# EAGLE design MainBoard (EAGLE 6.3)
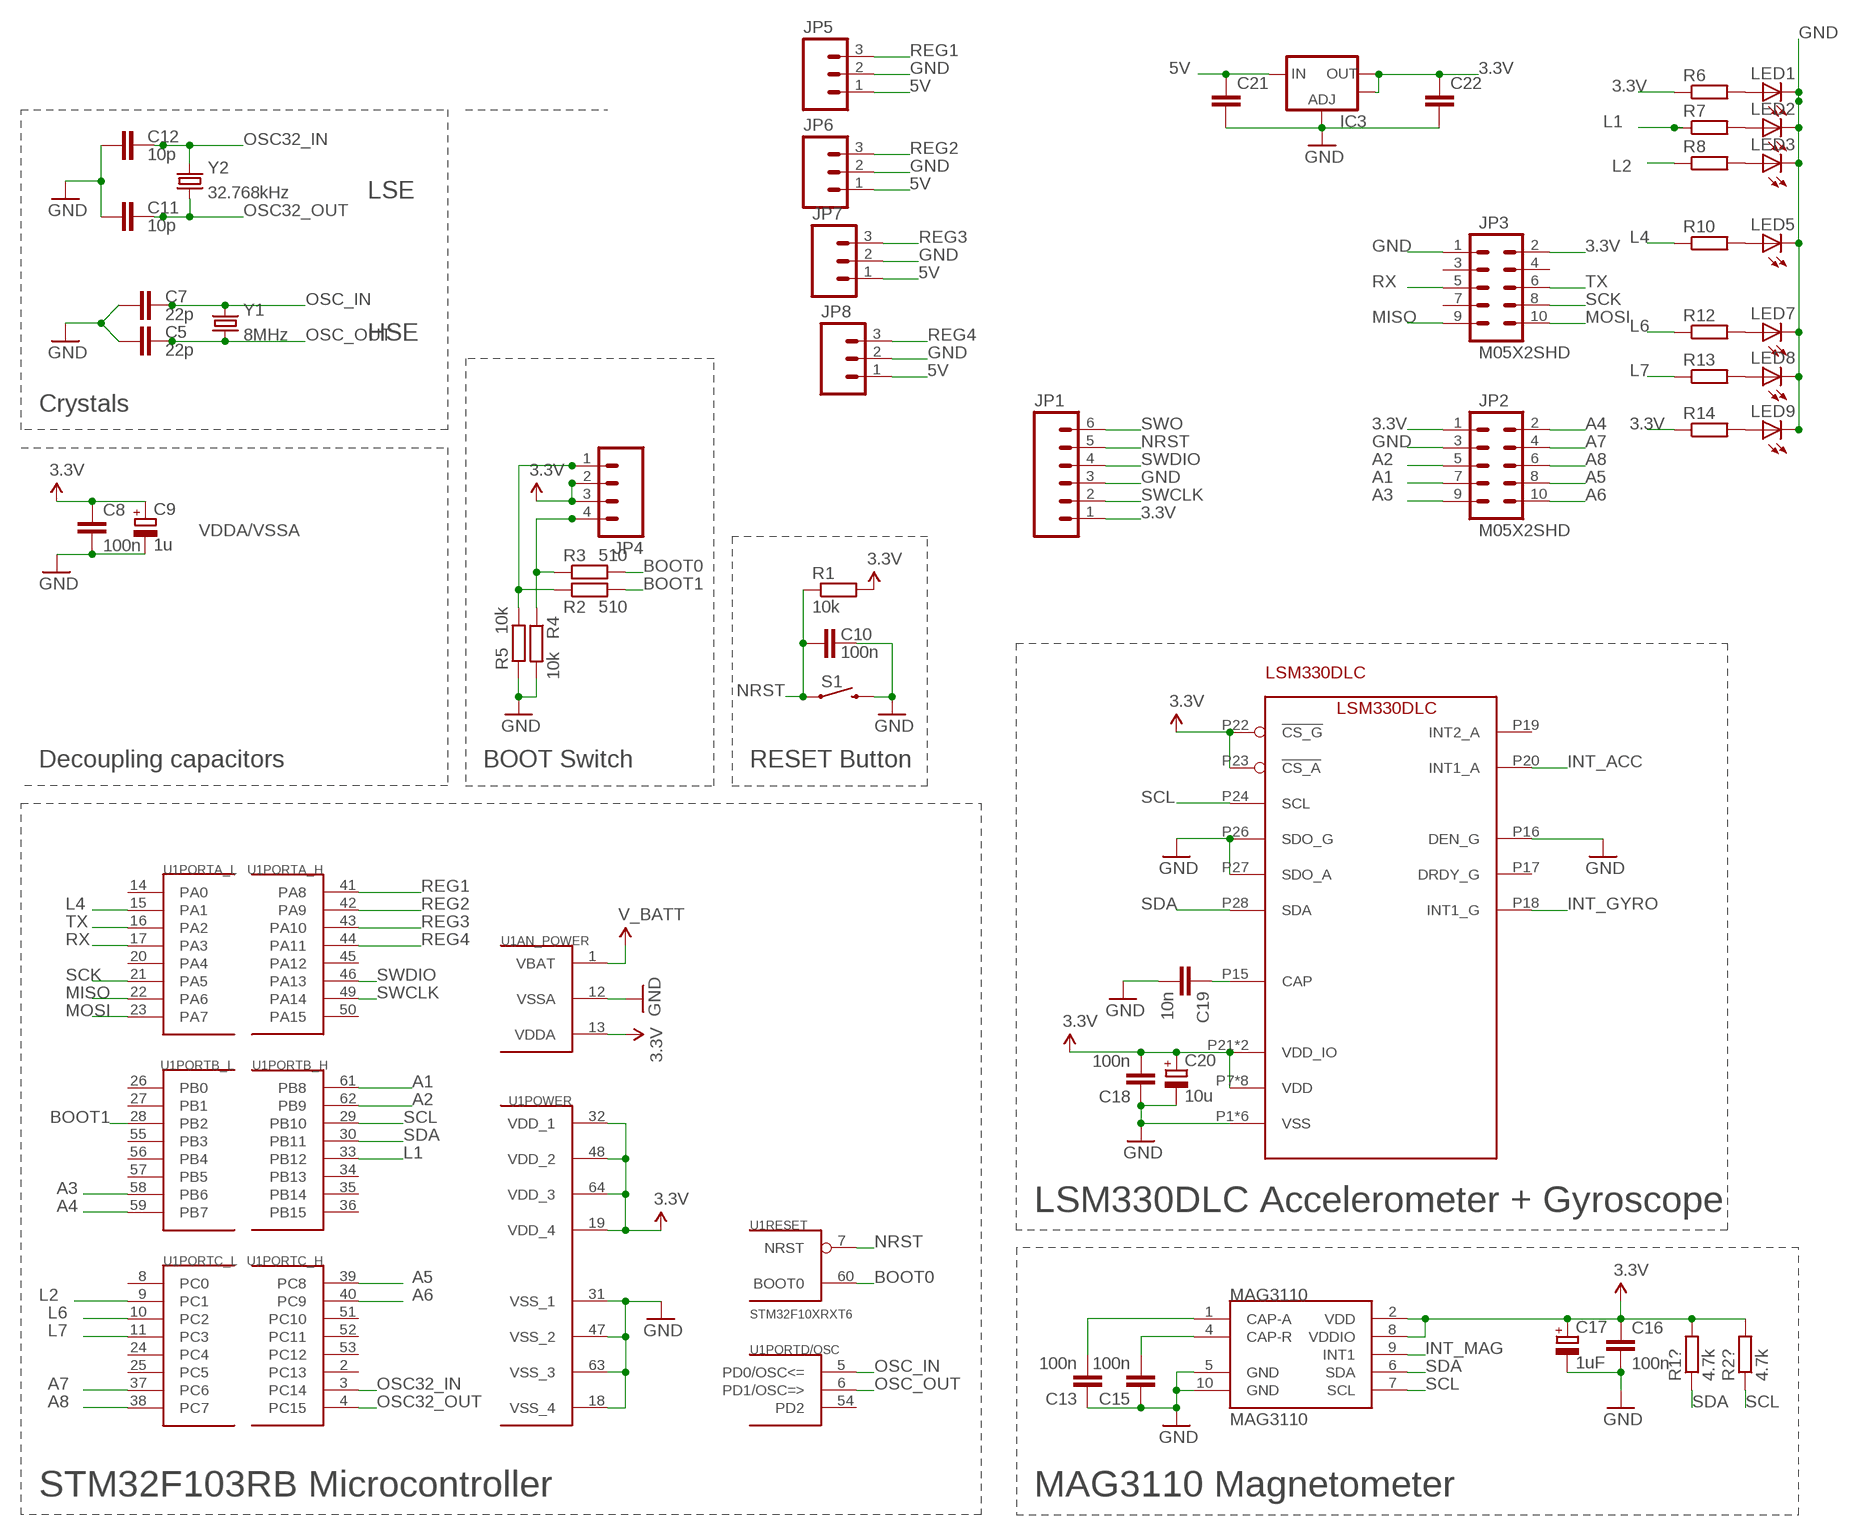
[diagram p0: schematic, sheet 1]

## Parts
C5  22p  C-EUC0805  [C0805]
C7  22p  C-EUC0805  [C0805]
C8  100n  C-EUC0805  [C0805]
C9  1u  CPOL-EUSMCA  [SMC_A]
C10  100n  C-EUC0805  [C0805]
C11  10p  C-EUC0805  [C0805]
C12  10p  C-EUC0805  [C0805]
C13  100n  C-EUC0805  [C0805]
C15  100n  C-EUC0805  [C0805]
C16  100n  C-EUC0805  [C0805]
C17  1uF  CPOL-EUSMCA  [SMC_A]
C18  100n  C-EUC0805  [C0805]
C19  10n  C-EUC0805  [C0805]
C20  10u  CPOL-EUSMCA  [SMC_A]
C21  C-EUC0805  [C0805]
C22  C-EUC0805  [C0805]
IC3  V_REG_LM1117SOT223  [SOT223]
JP1  M06LONGPADS  [1X06_LONGPADS]
JP2  M05X2SHD  [2X5-SHROUDED]
JP3  M05X2SHD  [2X5-SHROUDED]
JP4  M04LONGPADS  [1X04_LONGPADS]
JP5  M03LONGPADS  [1X03_LONGPADS]
JP6  M03LONGPADS  [1X03_LONGPADS]
JP7  M03LONGPADS  [1X03_LONGPADS]
JP8  M03LONGPADS  [1X03_LONGPADS]
LED1  LEDCHIPLED_0805  [CHIPLED_0805]
LED2  LEDCHIPLED_0805  [CHIPLED_0805]
LED3  LEDCHIPLED_0805  [CHIPLED_0805]
LED5  LEDCHIPLED_0805  [CHIPLED_0805]
LED7  LEDCHIPLED_0805  [CHIPLED_0805]
LED8  LEDCHIPLED_0805  [CHIPLED_0805]
LED9  LEDCHIPLED_0805  [CHIPLED_0805]
LSM330DLC  LSM330DLC  [LGA_4X5X1P1_28L]
MAG3110  MAG3110  [DFN-10]
R1  10k  R-EU_R0805  [R0805]
R1?  4.7k  R-EU_R0805  [R0805]
R2  510  R-EU_R0805  [R0805]
R2?  4.7k  R-EU_R0805  [R0805]
R3  510  R-EU_R0805  [R0805]
R4  10k  R-EU_R0805  [R0805]
R5  10k  R-EU_R0805  [R0805]
R6  R-EU_M0805  [M0805]
R7  R-EU_M0805  [M0805]
R8  R-EU_M0805  [M0805]
R10  R-EU_M0805  [M0805]
R12  R-EU_M0805  [M0805]
R13  R-EU_M0805  [M0805]
R14  R-EU_M0805  [M0805]
S1  SWITCH-MOMENTARY-2-SMD-1101NE  [TACTILE-SWITCH-1101NE]
U1  STM32F10XRXT6  [TQFP64]
Y1  8MHz  CRYSTALSMD  [HC49UP]
Y2  32.768kHz  CRYSTALEPSONMC146  [CRYSTAL-32KHZ-SMD_EPSON_MC146]

## Nets
3.3V: C8.1 C9.+ C16.1 C17.+ C18.2 C20.+ C22.1 IC3.2(OUT) IC3.4(OUT) JP1.1 JP2.1 JP3.2 JP4.2 JP4.3 LSM330DLC.P7(VDD) LSM330DLC.P8(VDD) LSM330DLC.P9(VDD) LSM330DLC.P10(VDD) LSM330DLC.P11(VDD) LSM330DLC.P12(VDD) LSM330DLC.P13(VDD) LSM330DLC.P14(VDD) LSM330DLC.P21(VDD_IO) LSM330DLC.P22(!CS_G) LSM330DLC.P23(!CS_A) LSM330DLC.P25(VDD_IO) MAG3110.2(VDD) MAG3110.8(VDDIO) R1.2 R1?.2 R2?.2 R6.1 R14.1 U1.13(AN_POWER:VDDA) U1.19(POWER:VDD_4) U1.32(POWER:VDD_1) U1.48(POWER:VDD_2) U1.64(POWER:VDD_3)
5V: C21.1 IC3.3(IN) JP5.1 JP6.1 JP7.1 JP8.1
A1: JP2.7 U1.61(PORTB_H:PB8)
A2: JP2.5 U1.62(PORTB_H:PB9)
A3: JP2.9 U1.58(PORTB_L:PB6)
A4: JP2.2 U1.59(PORTB_L:PB7)
A5: JP2.8 U1.39(PORTC_H:PC8)
A6: JP2.10 U1.40(PORTC_H:PC9)
A7: JP2.4 U1.37(PORTC_L:PC6)
A8: JP2.6 U1.38(PORTC_L:PC7)
BOOT0: R3.2 U1.60(RESET:BOOT0)
BOOT1: R2.2 U1.28(PORTB_L:PB2)
GND: C5.1 C7.1 C8.2 C9.- C10.2 C11.1 C12.1 C13.1 C15.1 C16.2 C17.- C18.1 C19.2 C20.- C21.2 C22.2 IC3.1(ADJ) JP1.3 JP2.3 JP3.1 JP5.2 JP6.2 JP7.2 JP8.2 LED1.C LED2.C LED3.C LED5.C LED7.C LED8.C LED9.C LSM330DLC.P1(VSS) LSM330DLC.P2(VSS) LSM330DLC.P3(VSS) LSM330DLC.P4(VSS) LSM330DLC.P5(VSS) LSM330DLC.P6(VSS) LSM330DLC.P16(DEN_G) LSM330DLC.P26(SDO_G) LSM330DLC.P27(SDO_A) MAG3110.5(GND) MAG3110.10(GND) R4.2 R5.1 S1.P$2 U1.12(AN_POWER:VSSA) U1.18(POWER:VSS_4) U1.31(POWER:VSS_1) U1.47(POWER:VSS_2) U1.63(POWER:VSS_3)
INT_ACC: LSM330DLC.P20(INT1_A)
INT_GYRO: LSM330DLC.P18(INT1_G)
INT_MAG: MAG3110.9(INT1)
L1: R7.1 U1.33(PORTB_H:PB12)
L2: R8.1 U1.9(PORTC_L:PC1)
L4: R10.1 U1.15(PORTA_L:PA1)
L6: R12.1 U1.10(PORTC_L:PC2)
L7: R13.1 U1.11(PORTC_L:PC3)
MISO: JP3.9 U1.22(PORTA_L:PA6)
MOSI: JP3.10 U1.23(PORTA_L:PA7)
N$1: JP4.1 R2.1 R5.2
N$2: JP4.4 R3.1 R4.1
N$3: C15.2 MAG3110.4(CAP-R)
N$4: C13.2 MAG3110.1(CAP-A)
N$5: C19.1 LSM330DLC.P15(CAP)
N$6: LED1.A R6.2
N$7: LED2.A R7.2
N$8: LED3.A R8.2
N$10: LED5.A R10.2
N$12: LED7.A R12.2
N$13: LED8.A R13.2
N$14: LED9.A R14.2
NRST: C10.1 JP1.5 R1.1 S1.P$1 U1.7(RESET:NRST)
OSC32_IN: C12.2 U1.3(PORTC_H:PC14) Y2.P$1
OSC32_OUT: C11.2 U1.4(PORTC_H:PC15) Y2.P$2
OSC_IN: C7.2 U1.5(PORTD/OSC:PD0/OSC<=) Y1.2
OSC_OUT: C5.2 U1.6(PORTD/OSC:PD1/OSC=>) Y1.1
REG1: JP5.3 U1.41(PORTA_H:PA8)
REG2: JP6.3 U1.42(PORTA_H:PA9)
REG3: JP7.3 U1.43(PORTA_H:PA10)
REG4: JP8.3 U1.44(PORTA_H:PA11)
RX: JP3.5 U1.17(PORTA_L:PA3)
SCK: JP3.8 U1.21(PORTA_L:PA5)
SCL: LSM330DLC.P24(SCL) MAG3110.7(SCL) R2?.1 U1.29(PORTB_H:PB10)
SDA: LSM330DLC.P28(SDA) MAG3110.6(SDA) R1?.1 U1.30(PORTB_H:PB11)
SWCLK: JP1.2 U1.49(PORTA_H:PA14)
SWDIO: JP1.4 U1.46(PORTA_H:PA13)
SWO: JP1.6
TX: JP3.6 U1.16(PORTA_L:PA2)
V_BATT: U1.1(AN_POWER:VBAT)
Unconnected: JP3.3 JP3.4 JP3.7 LSM330DLC.P17(DRDY_G) LSM330DLC.P19(INT2_A) U1.2(PORTC_H:PC13) U1.8(PORTC_L:PC0) U1.14(PORTA_L:PA0) U1.20(PORTA_L:PA4) U1.24(PORTC_L:PC4) U1.25(PORTC_L:PC5) U1.26(PORTB_L:PB0) U1.27(PORTB_L:PB1) U1.34(PORTB_H:PB13) U1.35(PORTB_H:PB14) U1.36(PORTB_H:PB15) U1.45(PORTA_H:PA12) U1.50(PORTA_H:PA15) U1.51(PORTC_H:PC10) U1.52(PORTC_H:PC11) U1.53(PORTC_H:PC12) U1.54(PORTD/OSC:PD2) U1.55(PORTB_L:PB3) U1.56(PORTB_L:PB4) U1.57(PORTB_L:PB5)

## Notes on the sheet
- LSE
- HSE
- Crystals
- VDDA/VSSA
- Decoupling capacitors | BOOT Switch | RESET Button
- LSM330DLC Accelerometer + Gyroscope
- STM32F103RB Microcontroller | MAG3110 Magnetometer

## Library data of the parts
C5 C7 C8 C10-C13 C15 C16 C21 C22 = rcl:C-EU: CAPACITOR, European symbol
C9 C17 C20 = rcl:CPOL-EU: POLARIZED CAPACITOR, European symbol
C18 C19 = resistor:C-EU: CAPACITOR, European symbol
IC3 = SparkFun-PowerIC:V_REG_LM1117: Voltage Regulator LM1117 Standard adjustable voltage regulator but in SMD form. Spark Fun Electronics SKU : COM-00595
JP1 = SparkFun-Connectors:M06: Header 6 Standard 6-pin 0.1" header. Use with straight break away headers (SKU : PRT-00116), right angle break away headers (PRT-00553), swiss pins (PRT-00743), machine pins (PRT-00117), and female headers (PRT-00115). Molex polarized connector foot print use with SKU : PRT-08094 with associated crimp pins and housings. NOTES ON THE VARIANTS LOCK and LOCK_LONGPADS... This footprint was designed to help hold the alignment of a through-hole component (i.e. 6-pin header) while soldering it into place. You may notice that each hole has been shifted either up or down by 0.005 of an inch from it's more standard position (which is a perfectly straight line). This slight alteration caused the pins (the squares in the middle) to touch the edges of the holes. Because they are alternating, it causes a "brace" to hold the component in place. 0.005 has proven to be the perfect amount of "off-center" position when using our standard breakaway headers. Although looks a little odd when you look at the bare footprint, once you have a header in there, the alteration is very hard to notice. Also, if you push a header all the way into place, it is covered up entirely on the bottom side. This idea of altering the position of holes to aid alignment will be further integrated into the Sparkfun Library for other footprints. It can help hold any component with 3 or more connection pins.
JP2 JP3 = SparkFun-Connectors:M05X2: Header 5x2 Standard 10-pin dual row 0.1" header. Commonly used with AVR-ISP. Use with Spark Fun Electronics SKU: PRT-00778
JP4 = SparkFun-Connectors:M04: Header 4 Standard 4-pin 0.1" header. Use with straight break away headers (SKU : PRT-00116), right angle break away headers (PRT-00553), swiss pins (PRT-00743), machine pins (PRT-00117), and female headers (PRT-00115). Molex polarized connector foot print use with SKU : PRT-08231 with associated crimp pins and housings. 1MM SMD Version SKU: PRT-10208
JP5-JP8 = SparkFun-Connectors:M03: Header 3 Standard 3-pin 0.1" header. Use with straight break away headers (SKU : PRT-00116), right angle break away headers (PRT-00553), swiss pins (PRT-00743), machine pins (PRT-00117), and female headers (PRT-00115). Molex polarized connector foot print use with SKU : PRT-08232 with associated crimp pins and housings.
LED1-LED3 LED5 LED7-LED9 = led:LED: LED OSRAM: - CHIPLED LG R971, LG N971, LY N971, LG Q971, LY Q971, LO R971, LY R971 LH N974, LH R974 LS Q976, LO Q976, LY Q976 LO Q996 - Hyper CHIPLED LW Q18S LB Q993, LB Q99A, LB R99A - SideLED LS A670, LO A670, LY A670, LG A670, LP A670 LB A673, LV A673, LT A673, LW A673 LH A674 LY A675 LS A676, LA A676, LO A676, LY A676, LW A676 LS A679, LY A679, LG A679 - Hyper Micro SIDELED® LS Y876, LA Y876, LO Y876, LY Y876 LT Y87S - SmartLED LW L88C, LW L88S LB L89C, LB L89S, LG L890 LS L89K, LO L89K, LY L89K LS L896, LA L896, LO L896, LY L896 - TOPLED LS T670, LO T670, LY T670, LG T670, LP T670 LSG T670, LSP T670, LSY T670, LOP T670, LYG T670 LG T671, LOG T671, LSG T671 LB T673, LV T673, LT T673, LW T673 LH T674 LS T676, LA T676, LO T676, LY T676, LB T676, LH T676, LSB T676, LW T676 LB T67C, LV T67C, LT T67C, LS T67K, LO T67K, LY T67K, LW E67C LS E67B, LA E67B, LO E67B, LY E67B, LB E67C, LV E67C, LT E67C LW T67C LS T679, LY T679, LG T679 LS T770, LO T770, LY T770, LG T770, LP T770 LB T773, LV T773, LT T773, LW T773 LH T774 LS E675, LA E675, LY E675, LS T675 LS T776, LA T776, LO T776, LY T776, LB T776 LHGB T686 LT T68C, LB T68C - Hyper Mini TOPLED® LB M676 - Mini TOPLED Santana® LG M470 LS M47K, LO M47K, LY M47K Source: http://www.osram.convergy.de LUXEON: - LUMILED® LXK2-PW12-R00, LXK2-PW12-S00, LXK2-PW14-U00, LXK2-PW14-V00 LXK2-PM12-R00, LXK2-PM12-S00, LXK2-PM14-U00 LXK2-PE12-Q00, LXK2-PE12-R00, LXK2-PE12-S00, LXK2-PE14-T00, LXK2-PE14-U00 LXK2-PB12-K00, LXK2-PB12-L00, LXK2-PB12-M00, LXK2-PB14-N00, LXK2-PB14-P00, LXK2-PB14-Q00 LXK2-PR12-L00, LXK2-PR12-M00, LXK2-PR14-Q00, LXK2-PR14-R00 LXK2-PD12-Q00, LXK2-PD12-R00, LXK2-PD12-S00 LXK2-PH12-R00, LXK2-PH12-S00 LXK2-PL12-P00, LXK2-PL12-Q00, LXK2-PL12-R00 Source: www.luxeon.com KINGBRIGHT: KA-3528ASYC Source: www.kingbright.com
LSM330DLC = sensors-akc_zyr:LSM330DLC
MAG3110 = sparkfun-sensors (2):MAG3110: 3-axis digital (I2C) magnetometer
R1 R1? R2 R2? R3-R5 = rcl:R-EU_: RESISTOR, European symbol
R6-R8 R10 R12-R14 = resistor:R-EU_: RESISTOR, European symbol
S1 = SparkFun-Electromechanical:SWITCH-MOMENTARY-2: Various NO switches- pushbuttons, reed, etc
U1 = stm32:STM32F10XRXT6: STM32F101/103 64pin LQFP
Y1 Y2 = SparkFun-FreqCtrl:CRYSTAL: Various standard crystals. Proven footprints. Spark Fun Electronics SKU : COM-00534

## Board
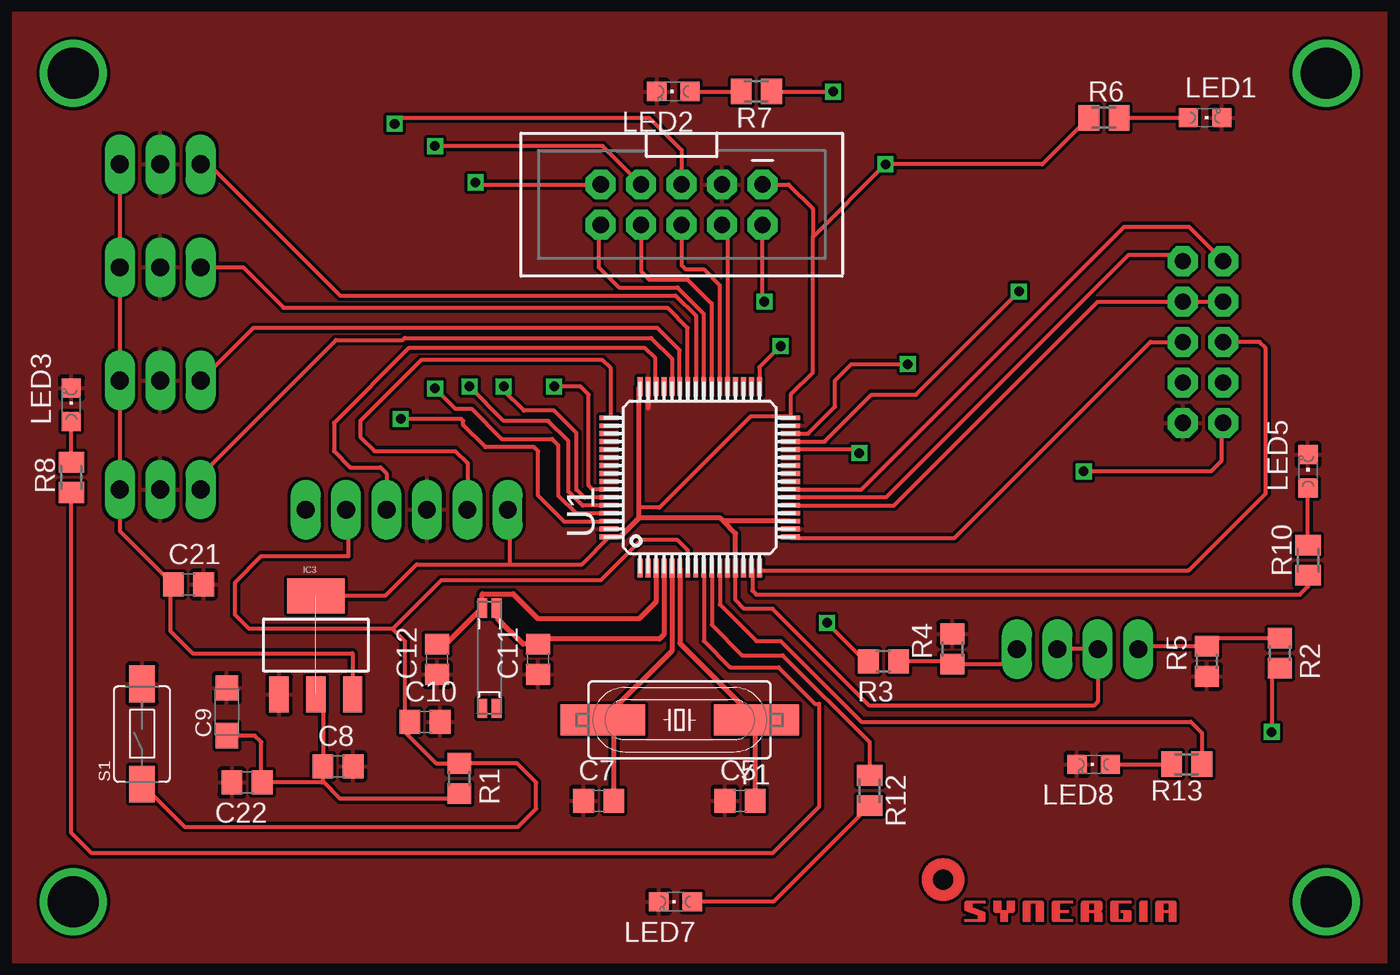
[diagram p1: board, top side]
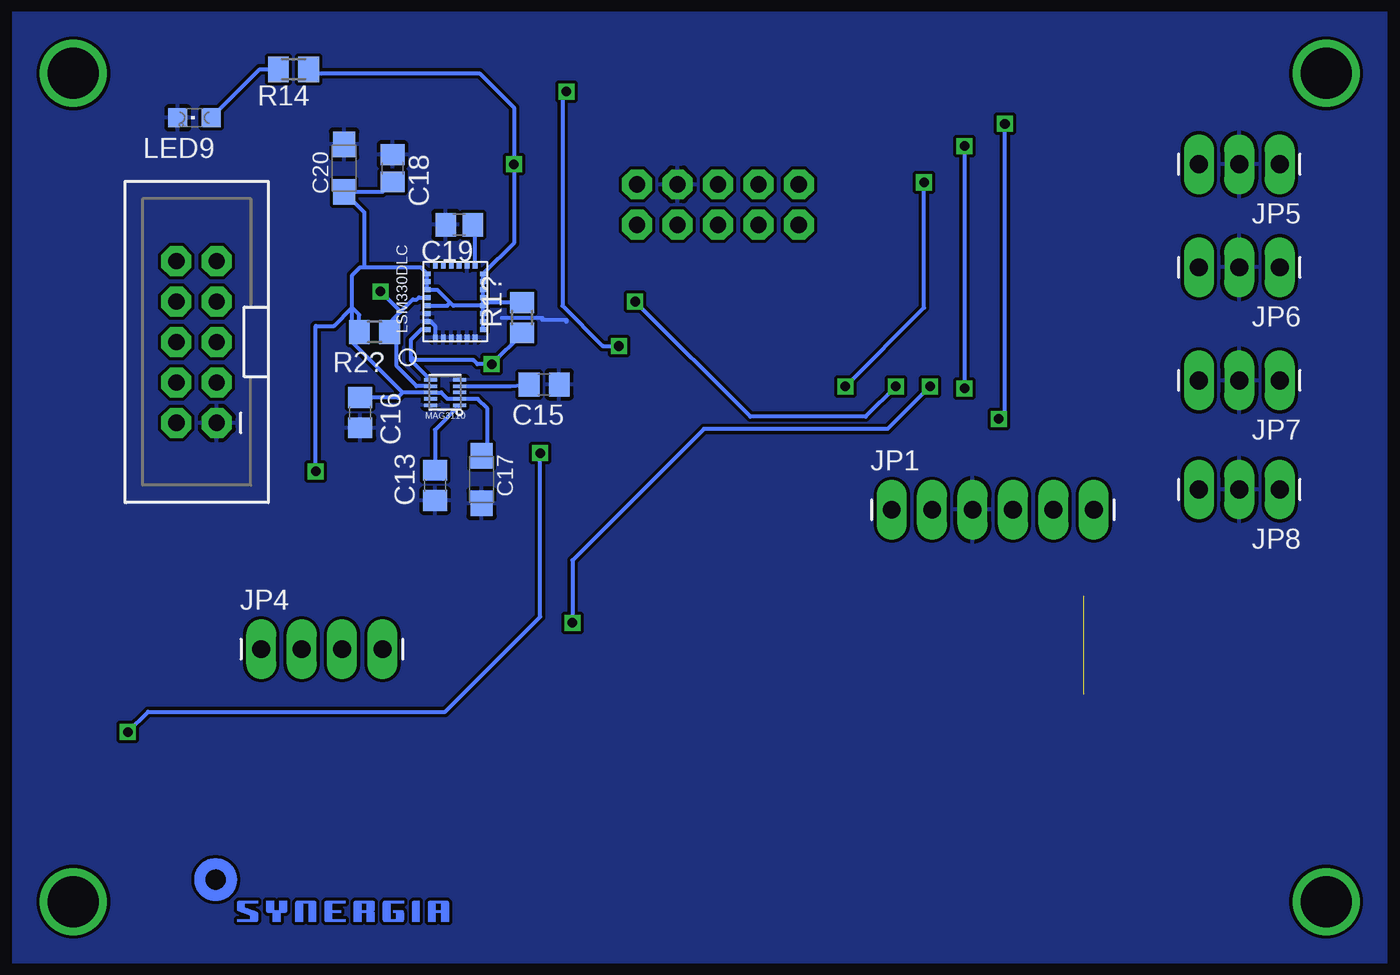
[diagram p2: board, bottom side, seen from below]

No outline drawn. Coordinates in mm, seen from the top.
Copper layers (1*16): Top 0.035mm / dielectric 1.5mm / Bottom 0.035mm
Design rules "default": minimum track width 10mil, minimum drill 24mil, track to track 8mil, track to pad 8mil, pad to pad 8mil, via to via 8mil, smd to smd 8mil, copper to edge 40mil, drill to drill 8mil, minimum pad ring 10mil, minimum via ring 8mil, stop-mask expansion 4mil, vias tented up to drill 0mil, thermal gap 10mil

### Footprints (pad centres in the part's own frame; a part is rotated, then mirrored left to right if it is on the bottom)
C0805 = smd 1.3 x 1.5: 1 -0.95,0; 2 0.95,0
SMC_A = smd 1.6 x 1.4: + -1.5,0; - 1.5,0
C0805' = smd 1.3 x 1.5: 1 -0.85,0; 2 0.85,0
SOT223 = smd 1.219 x 2.235: 1 -2.311,-3.099; 2 0,-3.099; 3 2.311,-3.099 | smd 3.6 x 2.2: 4 0,3.099
1X06_LONGPADS = drill 1.118 pad 1.88 long: 1 0,0; 2 2.54,0; 3 5.08,0; 4 7.62,0; 5 10.16,0; 6 12.7,0
2X5-SHROUDED = drill 1.016 pad 1.88 octagon: 1 -1.27,5.08; 2 1.27,5.08; 3 -1.27,2.54; 4 1.27,2.54; 5 -1.27,0; 6 1.27,0; 7 -1.27,-2.54; 8 1.27,-2.54; 9 -1.27,-5.08; 10 1.27,-5.08
1X04_LONGPADS = drill 1.118 pad 1.88 long: 1 0,0; 2 2.54,0; 3 5.08,0; 4 7.62,0
1X03_LONGPADS = drill 1.118 pad 1.88 long: 1 0,0; 2 2.54,0; 3 5.08,0
CHIPLED_0805 = smd 1.2 x 1.2: A 0,-1.05; C 0,1.05
LGA_4X5X1P1_28L = smd 0.4 x 0.3: P1 -2.263,1.25; P2 -2.263,0.75; P3 -2.263,0.25; P4 -2.263,-0.25; P5 -2.263,-0.75; P6 -2.263,-1.25; P15 2.263,-1.25; P16 2.263,-0.75; P17 2.263,-0.25; P18 2.263,0.25; P19 2.263,0.75; P20 2.263,1.25 | smd 0.3 x 0.4: P7 -1.75,-1.762; P8 -1.25,-1.762; P9 -0.75,-1.762; P10 -0.25,-1.762; P11 0.25,-1.762; P12 0.75,-1.762; P13 1.25,-1.762; P14 1.75,-1.762; P21 1.75,1.762; P22 1.25,1.762; P23 0.75,1.762; P24 0.25,1.762; P25 -0.25,1.762; P26 -0.75,1.762; P27 -1.25,1.762; P28 -1.75,1.762
DFN-10 = smd 0.8 x 0.22: 1 -0.91,0.8; 2 -0.91,0.4; 3 -0.91,0; 4 -0.91,-0.4; 5 -0.91,-0.8; 6 0.91,-0.8; 7 0.91,-0.4; 8 0.91,0; 9 0.91,0.4; 10 0.91,0.8
R0805 = smd 1.3 x 1.5: 1 -0.95,0; 2 0.95,0
M0805 = smd 1.3 x 1.6: 1 -0.95,0; 2 0.95,0
TACTILE-SWITCH-1101NE = smd 2.3 x 1.6: P$1 -3.15,0; P$2 3.15,0
TQFP64 = smd 1.2 x 0.3: 1 -5.7,3.75; 2 -5.7,3.25; 3 -5.7,2.75; 4 -5.7,2.25; 5 -5.7,1.75; 6 -5.7,1.25; 7 -5.7,0.75; 8 -5.7,0.25; 9 -5.7,-0.25; 10 -5.7,-0.75; 11 -5.7,-1.25; 12 -5.7,-1.75; 13 -5.7,-2.25; 14 -5.7,-2.75; 15 -5.7,-3.25; 16 -5.7,-3.75; 33 5.7,-3.75; 34 5.7,-3.25; 35 5.7,-2.75; 36 5.7,-2.25; 37 5.7,-1.75; 38 5.7,-1.25; 39 5.7,-0.75; 40 5.7,-0.25; 41 5.7,0.25; 42 5.7,0.75; 43 5.7,1.25; 44 5.7,1.75; 45 5.7,2.25; 46 5.7,2.75; 47 5.7,3.25; 48 5.7,3.75 | smd 0.3 x 1.2: 17 -3.75,-5.7; 18 -3.25,-5.7; 19 -2.75,-5.7; 20 -2.25,-5.7; 21 -1.75,-5.7; 22 -1.25,-5.7; 23 -0.75,-5.7; 24 -0.25,-5.7; 25 0.25,-5.7; 26 0.75,-5.7; 27 1.25,-5.7; 28 1.75,-5.7; 29 2.25,-5.7; 30 2.75,-5.7; 31 3.25,-5.7; 32 3.75,-5.7; 49 3.75,5.7; 50 3.25,5.7; 51 2.75,5.7; 52 2.25,5.7; 53 1.75,5.7; 54 1.25,5.7; 55 0.75,5.7; 56 0.25,5.7; 57 -0.25,5.7; 58 -0.75,5.7; 59 -1.25,5.7; 60 -1.75,5.7; 61 -2.25,5.7; 62 -2.75,5.7; 63 -3.25,5.7; 64 -3.75,5.7
HC49UP = smd 5.334 x 1.93: 1 -4.826,0; 2 4.826,0
CRYSTAL-32KHZ-SMD_EPSON_MC146 = smd 1.2 x 0.6: NC1 6.9,1.2; NC2 6.9,0.3; P$1 0.6,0.3; P$2 0.6,1.2

### Placement (x,y rotation side)
C5  26.67,12.7 0 top
C7  17.78,12.7 0 top
C8  1.4,14.86 0 top
C9  -5.59,18.29 90 top
C10  6.86,17.65 0 top
C11  13.97,21.59 90 top
C12  7.62,21.59 90 top
C13  40.77,32.51 90 bottom
C15  33.91,38.86 180 bottom
C16  45.47,37.08 270 bottom
C17  37.85,32.89 270 bottom
C18  100n  [C0805']  43.43,52.45 270 bottom
C19  10n  [C0805']  39.24,48.9 180 bottom
C20  46.48,52.45 90 bottom
C21  -8,26.29 0 top
C22  -4.32,13.84 180 top
IC3  0,22.48 0 top
JP1  12.06,30.99 0 bottom
JP2  22.99,50.16 270 top
JP3  55.75,41.53 180 bottom
JP4  51.69,22.23 0 bottom
JP5  -12.32,52.7 180 bottom
JP6  -12.32,46.23 180 bottom
JP7  -12.32,39.12 180 bottom
JP8  -12.32,32.26 180 bottom
LED1  55.88,55.63 270 top
LED2  22.48,57.28 90 top
LED3  -15.37,37.59 0 top
LED5  62.36,33.4 0 top
LED7  22.61,6.35 90 top
LED8  48.9,14.99 90 top
LED9  55.88,55.63 90 bottom
LSM330DLC  39.5,44.07 90 bottom
MAG3110  40.13,38.35 180 bottom
R1  9.02,14.1 270 top
R1?  35.31,43.05 90 bottom
R2  60.58,21.97 270 top
R2?  44.58,42.16 180 bottom
R3  35.69,21.46 180 top
R4  40.01,22.23 90 top
R5  56.01,21.46 90 top
R6  49.53,55.63 0 top
R7  27.69,57.28 180 top
R8  -15.37,33.02 90 top
R10  62.36,27.81 90 top
R12  34.8,13.34 270 top
R13  54.74,14.99 180 top
R14  49.66,58.67 180 bottom
S1  -10.92,16.89 90 top
U1  24.13,33.02 90 top
U$1  [SYNERGIA_16MM]  38.1,5.08 0 top
U$2  [SYNERGIA_16MM]  55.88,5.08 0 bottom
Y1  22.86,17.78 180 top
Y2  10.16,25.4 270 top

### Tracks (layer width: path | path; a pad name or v marks a point on that pad's centre or on a via)
3.3V  (via drill 0.6)  (1 unrouted)
  Top 0.254: 20.32,31.11 21.59,31.11 27.3,36.83 29.77,36.83 U1.32 29.84,36.78 29.84,38.23 31.24,39.62 31.24,48.13 | JP2.1 29.72,51.44 31.24,49.91 31.24,48.13 | 31.24,48.13 v35.81,52.7 45.66,52.7 R6.1 | 12.19,27.56 6.35,27.56 4.37,25.58 IC3.4 | 12.19,27.56 16.72,27.56 U1.64 | 0,19.18 0.13,19.3 0.08,19.3 IC3.2 0.45,18.93 C8.1 0.45,13.9 | 9.14,13.02 R1.2 8.7,12.83 1.52,12.83 0.45,13.9 | 0.45,13.9 0.39,13.84 C22.1 -3.43,13.9 -3.43,16.38 -3.83,16.79 C9.+ | JP4.3 JP4.2 49.15,18.92 48.9,18.67 34.8,18.67 28.7,24.77 26.92,24.77 26.38,25.31 U1.13 | JP1.1 12.19,30.86 12.19,27.56 | JP3.2 56.9,36.32 56.9,34.04 56.26,33.4 v48.26,33.4
  Top 0.305: U1.64 19.11,29.27 20.32,30.48 | 20.32,30.48 20.32,31.11 20.32,38.66 U1.48 | U1.13 26.38,29.5 25.61,30.27 | 20.32,30.48 25.4,30.48 25.61,30.27 | U1.19 25.61,30.27
  Bottom 0.254: 39.81,44.01 40.63,44.82 LSM330DLC.P23 LSM330DLC.P22 LSM330DLC.P21 41.67,46.23 45.21,46.23 | 39.81,44.01 39.62,43.81 39.62,43.82 LSM330DLC.P10 | LSM330DLC.P25 40,43.82 39.81,44.01 | LSM330DLC.P7 LSM330DLC.P8 LSM330DLC.P9 LSM330DLC.P10 | LSM330DLC.P10 LSM330DLC.P11 | LSM330DLC.P11 LSM330DLC.P12 LSM330DLC.P13 LSM330DLC.P14 35.81,47.74 v35.81,52.7 35.81,56.26 37.97,58.42 48.45,58.42 R14.1 | 42.8,38.35 MAG3110.8 40.39,38.35 40.01,37.97 39.24,37.97 MAG3110.2 38.08,37.95 37.47,37.34 37.47,34.77 C17.+ | 42.8,38.35 45.97,41.53 45.97,43.69 | 45.97,43.69 45.97,45.72 45.47,46.23 45.21,46.23 | R1?.2 37.42,44 LSM330DLC.P11 | R2?.2 45.53,43.24 45.97,43.69 | v48.26,33.4 48.26,42.55 47.12,42.55 45.97,43.69 | C18.2 44.08,50.95 C20.+ 45.21,49.68 45.21,46.23 | 42.8,38.35 43.12,38.03 C16.1
5V
  Top 0.254: IC3.3 2.31,21.95 2.29,21.97 -7.75,21.97 -9.14,23.37 -9.14,26.1 C21.1 -12.32,29.66 JP8.1 JP7.1 JP6.1 -12.32,46.48 JP5.1
A1  (via drill 0.6)
  Top 0.254: JP2.7 18.03,53.85 v7.49,53.85 | v7.49,38.61 8.76,37.34 9.78,37.34 11.68,35.43 14.86,35.43 15.24,35.05 15.24,31.88 16.35,30.77 U1.61
  Bottom 0.254: v7.49,53.85 v7.49,38.61
A2  (via drill 0.6)
  Top 0.254: U1.62 18.39,30.23 15.62,30.23 13.97,31.88 13.97,34.67 13.72,34.92 10.67,34.92 9.27,36.32 9.27,36.58 9.14,36.7 v5.33,36.7 | v4.95,55.24 5.33,55.63 20.95,55.63 22.99,53.59 JP2.5
  Bottom 0.254: v5.33,36.7 4.95,37.08 v4.95,55.24
A3  (via drill 0.6)
  Top 0.254: U1.58 18.42,32.26 17.4,32.26 17.14,32.51 17.14,38.23 16.64,38.73 v14.99,38.73 | v10.03,51.56 10.16,51.44 JP2.9
  Bottom 0.254: v14.99,38.73 10.03,43.69 v10.03,51.56
A4  (via drill 0.6)
  Top 0.254: U1.59 18.41,31.75 16.89,31.75 16.38,32.26 16.38,35.81 14.99,37.21 13.08,37.21 11.81,38.48 v11.81,38.73 | v28.19,44.07 28.07,44.2 JP2.2
  Bottom 0.254: v11.81,38.73 13.72,36.83 20.95,36.83 v28.19,44.07
A5
  Top 0.254: JP2.8 20.32,48.77 20.45,48.64 20.45,45.97 20.95,45.47 23.37,45.47 24.88,43.95 U1.39
A6
  Top 0.254: JP2.10 17.78,48.77 17.78,46.23 19.05,44.96 22.73,44.96 24.38,43.31 U1.40
A7
  Top 0.254: JP2.4 25.88,48.54 U1.37
A8
  Top 0.254: JP2.6 22.99,46.35 23.24,46.1 24.38,46.1 25.38,45.1 U1.38
BOOT0  (via drill 0.6)
  Top 0.254: U1.60 18.4,31.24 16.76,31.24 15.88,32.13 15.88,35.31 14.61,36.58 11.81,36.58 v9.65,38.73 | v32.13,23.88 34.54,21.46 R3.2
  Bottom 0.254: v9.65,38.73 12.32,36.07 23.88,36.07 32.13,27.81 v32.13,23.88
BOOT1  (via drill 0.6)
  Top 0.254: R2.2 60.58,21.08 60.07,20.57 v60.07,17.02 | v34.16,34.54 33.94,34.77 U1.28
  Bottom 0.254: v60.07,17.02 58.8,18.29 40.13,18.29 34.16,24.26 v34.16,34.54
GND
  Top 0.305: U1.47 20.88,37.39
  Bottom 0.254: LSM330DLC.P27 41.04,42.82 40.77,42.55 40.77,41.83 LSM330DLC.P1 | 36.58,43.05 34.04,43.05 34.04,42.93 32.51,42.93 32.51,42.8
  pour Top: -19.05,62.23 -19.05,2.54 67.31,2.54 67.31,62.23
  pour Bottom: -19.05,62.23 67.31,62.23 67.31,2.54 -19.05,2.54
L1  (via drill 0.6)
  Top 0.254: R7.1 v32.51,57.28 | v29.21,41.27 27.88,39.95 U1.33
  Bottom 0.254: v32.51,57.28 32.77,57.02 32.77,43.81 30.23,41.27 v29.21,41.27
L2
  Top 0.254: U1.9 24.38,22.73 26.04,21.08 29.08,21.08 31.37,18.8 31.62,18.8 31.62,12.32 28.7,9.4 -14.1,9.4 -15.37,10.67 R8.1
L4
  Top 0.254: U1.15 27.43,27.27 27.43,25.91 27.69,25.65 61.85,25.65 62.36,26.16 R10.1
L6
  Top 0.254: U1.10 24.89,27.31 24.89,23.75 26.8,21.84 29.34,21.84 34.8,16.38 R12.1
L7
  Top 0.254: U1.11 25.4,27.3 25.4,25.02 27.69,22.73 29.21,22.73 34.29,17.65 54.99,17.65 55.69,16.96 R13.1
MISO
  Top 0.254: JP3.9 54.1,46.99 51.05,46.99 35.83,31.77 U1.22
MOSI
  Top 0.254: JP3.10 54.86,48.77 50.8,48.77 34.29,32.26 29.84,32.26 U1.23
N$1
  Top 0.254: JP4.1 51.88,22.41 R5.2 56.52,22.92 R2.1
N$2
  Top 0.254: JP4.4 43.12,21.27 R4.1 39.82,21.46 R3.1
N$3
  Bottom 0.254: MAG3110.4 36.03,38.75 C15.2
N$4
  Bottom 0.254: MAG3110.1 40.77,36.01 C13.2
N$5
  Bottom 0.254: LSM330DLC.P15 38.25,48.75 C19.1
N$6
  Top 0.254: R6.2 LED1.A
N$7
  Top 0.254: LED2.A R7.2
N$8
  Top 0.254: R8.2 LED3.A
N$9  (via drill 3.2)
  other vias: -15.24,58.42
N$10
  Top 0.254: R10.2 LED5.A
N$11  (via drill 3.2)
  other vias: 63.5,58.42
N$12
  Top 0.254: R12.2 28.76,6.35 LED7.A
N$13
  Top 0.254: LED8.A R13.2
N$14
  Bottom 0.254: LED9.A 51.78,58.67 R14.2
N$15  (via drill 3.2)
  other vias: 63.5,6.35
N$16  (via drill 3.2)
  other vias: -15.24,6.35
NRST
  Top 0.254: U1.7 23.38,28.44 22.73,29.08 20.45,29.08 17.91,26.54 7.87,26.54 4.83,23.5 | 4.83,23.5 -4.19,23.5 -5.08,24.38 -5.08,26.42 -3.43,28.07 2.03,28.07 2.03,30.86 JP1.5 | 4.83,23.5 5.59,22.73 5.59,17.4 | 5.59,17.4 5.59,17.02 7.56,15.05 R1.1 12.64,15.05 13.84,13.84 13.84,12.19 12.7,11.05 -8.23,11.05 S1.P$1 | C10.1 5.65,17.4 5.59,17.4
OSC32_IN
  Top 0.305: U1.3 21.38,25.19 20.32,24.13 13.97,24.13 12.4,25.7 10.46,25.7 Y2.P$1 8.2,22.54 C12.2
OSC32_OUT
  Top 0.305: U1.4 21.88,23.15 21.59,22.86 14.29,22.86 C11.2 13.02,22.54 11.43,24.13 11.43,24.73 Y2.P$2
OSC_IN
  Top 0.305: U1.5 22.38,22.13 Y1.2 18.73,17.08 C7.2
OSC_OUT
  Top 0.305: U1.6 22.88,22.59 Y1.1 27.62,17.71 C5.2
REG1
  Top 0.254: U1.41 23.88,43.18 22.61,44.45 1.52,44.45 -6.6,52.58 -7.11,52.58 JP5.3
REG2
  Top 0.254: U1.42 23.37,38.73 23.37,42.42 22.1,43.69 -2.03,43.69 -4.57,46.23 JP6.3
REG3
  Top 0.254: U1.43 22.86,38.74 22.86,41.02 21.46,42.42 -3.94,42.42 JP7.3
REG4
  Top 0.254: U1.44 22.38,40.48 21.08,41.78 5.59,41.78 5.46,41.66 1.27,41.66 -7.24,33.15 JP8.3
RX
  Top 0.254: U1.17 29.89,29.21 40.13,29.21 52.45,41.53 JP3.5
SCK
  Top 0.254: U1.21 29.86,31.24 36.32,31.24 49.15,44.07 JP3.8
SCL  (via drill 0.6)
  Top 0.254: U1.29 31.97,35.27 34.92,38.23 37.72,38.23 v44.2,44.7
  Bottom 0.254: MAG3110.7 41.93,38.75 43.18,40.01 43.18,43.18 | 43.18,43.18 42.93,43.43 | 42.93,43.43 42.16,44.2 41.91,44.2 41.78,44.32 LSM330DLC.P24 | v44.2,44.7 42.93,43.43 | R2?.1 43.63,42.73 43.18,43.18
SDA  (via drill 0.6)
  Top 0.254: U1.30 30.94,35.77 32.64,37.47 32.64,39.12 33.66,40.13 v37.21,40.13
  Bottom 0.254: LSM330DLC.P28 41.63,42.32 42.29,41.66 42.29,40.64 | 42.29,40.64 42.29,40.4 MAG3110.6 | 42.29,40.64 42.04,40.39 38.35,40.39 38.1,40.13 v37.21,40.13 35.31,42.04 R1?.1
SWCLK
  Top 0.254: U1.49 18.54,36.88 18.54,39.88 18.03,40.39 6.6,40.39 2.79,36.58 2.79,35.56 3.68,34.67 8.76,34.67 9.53,33.91 JP1.2
SWDIO
  Top 0.254: U1.46 21.34,38.76 21.34,40.51 20.7,41.15 5.84,41.15 1.14,36.45 1.14,34.67 2.16,33.66 4.06,33.66 4.45,33.27 JP1.4
TX
  Top 0.254: U1.16 28.02,27.18 54.86,27.18 59.69,32 59.69,41.15 59.31,41.53 JP3.6